# Altium schematic sheet ANA_FE_1_2.SchDoc: Analog FE:1,2
size Letter; Organization: University of California; Address1: 475 Portola Plaza; Address2: Los Angeles, CA 90095; Revision: R01; SheetNumber: 1; SheetTotal: 1
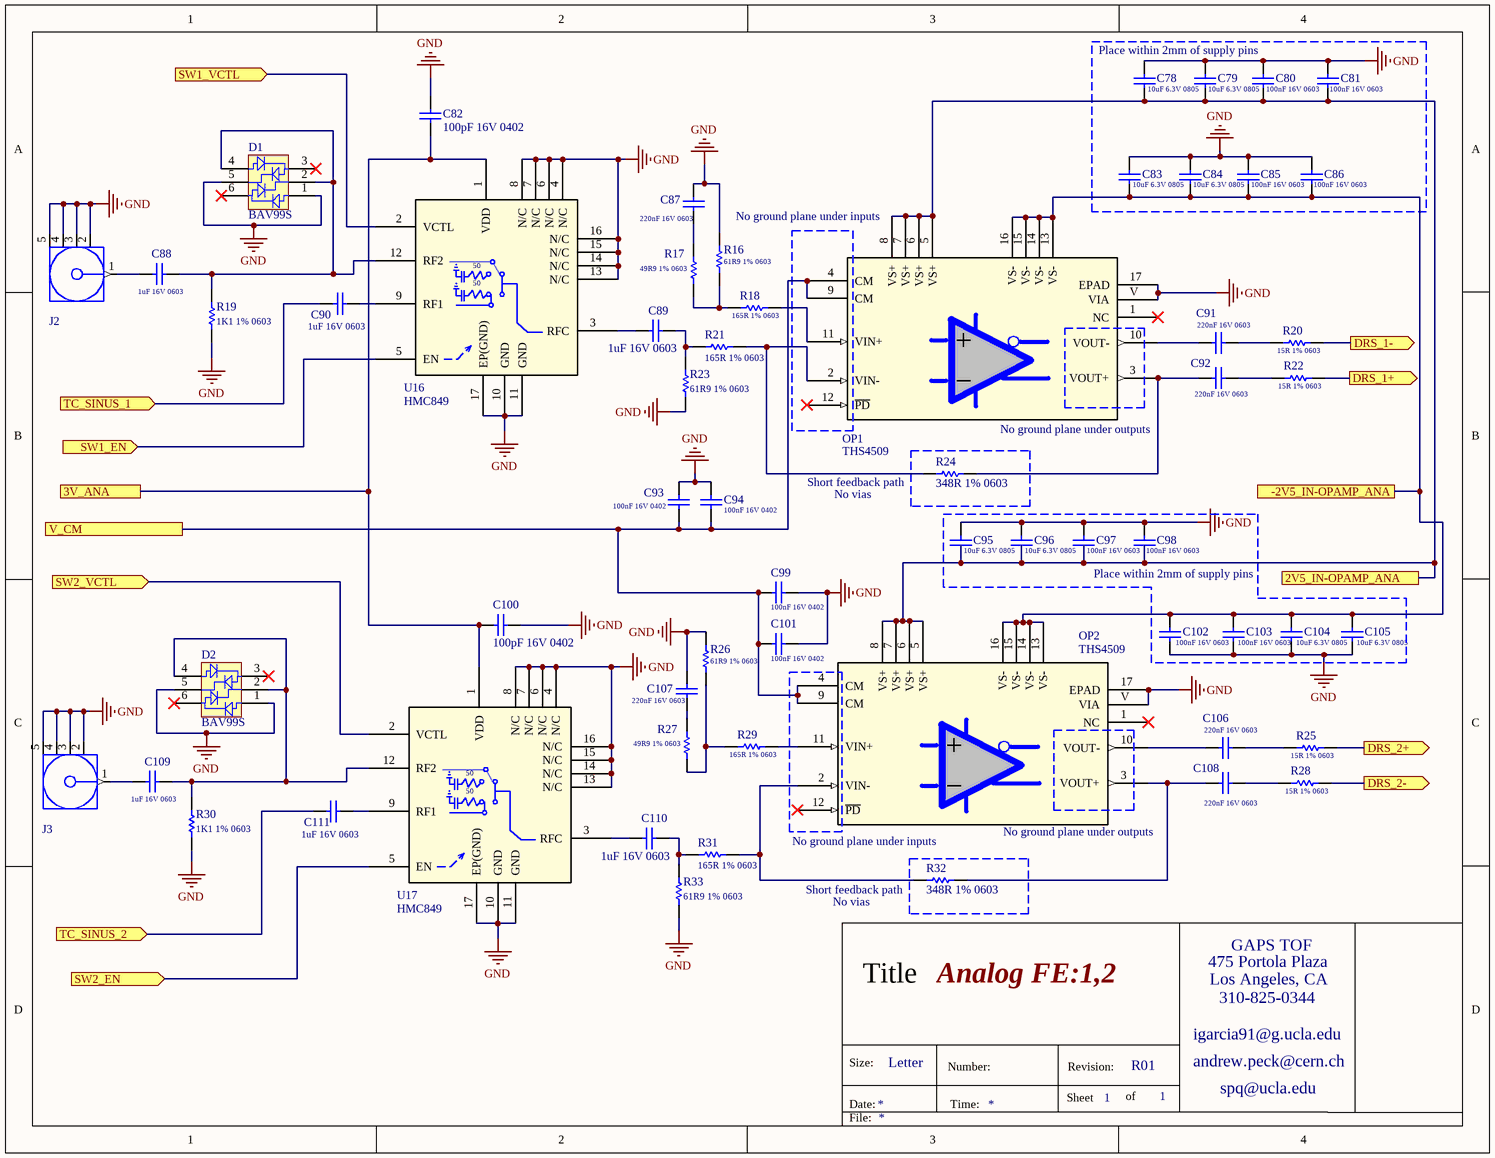
[diagram p0: ANA_FE_1_2.SchDoc]

## Parts
C78  10uF 6.3V 0805  [CAPC0805(2012)145_L]
C79  10uF 6.3V 0805  [CAPC0805(2012)145_L]
C80  100nF 16V 0603  [CAPC0603(1608)100_N]
C81  100nF 16V 0603  [CAPC0603(1608)100_N]
C82  100pF 16V 0402  [CAPC0402(1005)60_M]
C83  10uF 6.3V 0805  [CAPC0805(2012)145_L]
C84  10uF 6.3V 0805  [CAPC0805(2012)145_L]
C85  100nF 16V 0603  [CAPC0603(1608)100_N]
C86  100nF 16V 0603  [CAPC0603(1608)100_N]
C87  220nF 16V 0603  [CAPC0603(1608)100_M]
C88  1uF 16V 0603  [CAPC0603(1608)100_N]
C89  1uF 16V 0603  [CAPC0603(1608)100_N]
C90  1uF 16V 0603  [CAPC0603(1608)100_N]
C91  220nF 16V 0603  [CAPC0603(1608)100_M]
C92  220nF 16V 0603  [CAPC0603(1608)100_M]
C93  100nF 16V 0402  [CAPC0402(1005)60_M]
C94  100nF 16V 0402  [CAPC0402(1005)60_M]
C95  10uF 6.3V 0805  [CAPC0805(2012)145_L]
C96  10uF 6.3V 0805  [CAPC0805(2012)145_L]
C97  100nF 16V 0603  [CAPC0603(1608)100_N]
C98  100nF 16V 0603  [CAPC0603(1608)100_N]
C99  100nF 16V 0402  [CAPC0402(1005)60_M]
C100  100pF 16V 0402  [CAPC0402(1005)60_M]
C101  100nF 16V 0402  [CAPC0402(1005)60_M]
C102  100nF 16V 0603  [CAPC0603(1608)100_N]
C103  100nF 16V 0603  [CAPC0603(1608)100_N]
C104  10uF 6.3V 0805  [CAPC0805(2012)145_L]
C105  10uF 6.3V 0805  [CAPC0805(2012)145_L]
C106  220nF 16V 0603  [CAPC0603(1608)100_M]
C107  220nF 16V 0603  [CAPC0603(1608)100_M]
C108  220nF 16V 0603  [CAPC0603(1608)100_M]
C109  1uF 16V 0603  [CAPC0603(1608)100_N]
C110  1uF 16V 0603  [CAPC0603(1608)100_N]
C111  1uF 16V 0603  [CAPC0603(1608)100_N]
D1  BAV99S  [INF-SOT363_V]
D2  BAV99S  [INF-SOT363_V]
J2  CONREVSMA003.062  [CON-SMA-EDGE062]  (value not drawn)
J3  CONREVSMA003.062  [CON-SMA-EDGE062]  (value not drawn)
OP1  THS4509  [RGT16]
OP2  THS4509  [RGT16]
R16  61R9 1% 0603  [RESC0603(1608)_M]
R17  49R9 1% 0603  [RESC0603(1608)_N]
R18  165R 1% 0603  [RESC0603(1608)_M]
R19  1K1 1% 0603  [RESC0603(1608)_N]
R20  15R 1% 0603  [RESC0603(1608)_M]
R21  165R 1% 0603  [RESC0603(1608)_M]
R22  15R 1% 0603  [RESC0603(1608)_M]
R23  61R9 1% 0603  [RESC0603(1608)_M]
R24  348R 1% 0603  [RESC0603(1608)_N]
R25  15R 1% 0603  [RESC0603(1608)_M]
R26  61R9 1% 0603  [RESC0603(1608)_M]
R27  49R9 1% 0603  [RESC0603(1608)_N]
R28  15R 1% 0603  [RESC0603(1608)_M]
R29  165R 1% 0603  [RESC0603(1608)_M]
R30  1K1 1% 0603  [RESC0603(1608)_N]
R31  165R 1% 0603  [RESC0603(1608)_M]
R32  348R 1% 0603  [RESC0603(1608)_N]
R33  61R9 1% 0603  [RESC0603(1608)_M]
U16  HMC849  [CP_16_40]
U17  HMC849  [CP_16_40]

## Blocks framed on the sheet
Place within 2mm of supply pins: C78-C81 C83-C86
No ground plane under outputs: R24
Place within 2mm of supply pins: C95-C98 C102-C105
No ground plane under outputs: R32

## Ports
2V5_IN-OPAMP_ANA, 3V_ANA, -2V5_IN-OPAMP_ANA, DRS_1+ (out), DRS_1- (out), DRS_2+ (out), DRS_2- (out), SW1_EN (in), SW1_VCTL (in), SW2_EN (in), SW2_VCTL (in), TC_SINUS_1 (in), TC_SINUS_2 (in), V_CM

## Nets
GND: C78.2 C79.2 C80.2 C81.2 C82.2 C83.2 C84.2 C85.2 C86.2 C87.2 C93.1 C94.1 C95.2 C96.2 C97.2 C98.2 C99.1 C100.1 C101.1 C102.2 C103.2 C104.2 C105.2 C107.2 D1.1(A1) D1.5(K5) D2.1(A1) D2.5(K5) J2.2(GND) J2.3(GND) J2.4(GND) J2.5(GND) J3.2(GND) J3.3(GND) J3.4(GND) J3.5(GND) OP1.17(EPAD) OP1.V(VIA) OP2.17(EPAD) OP2.V(VIA) R16.2 R19.1 R23.1 R26.2 R30.1 R33.1 U16.4(N/C) U16.6(N/C) U16.7(N/C) U16.8(N/C) U16.10(GND) U16.11(GND) U16.13(N/C) U16.14(N/C) U16.15(N/C) U16.16(N/C) U16.17(EP(GND)) U17.4(N/C) U17.6(N/C) U17.7(N/C) U17.8(N/C) U17.10(GND) U17.11(GND) U17.13(N/C) U17.14(N/C) U17.15(N/C) U17.16(N/C) U17.17(EP(GND))
2V5_IN-OPAMP_ANA: C78.1 C79.1 C80.1 C81.1 C95.1 C96.1 C97.1 C98.1 OP1.5(VS+) OP1.6(VS+) OP1.7(VS+) OP1.8(VS+) OP2.5(VS+) OP2.6(VS+) OP2.7(VS+) OP2.8(VS+) ; port 2V5_IN-OPAMP_ANA
3V_ANA: C82.1 C100.2 U16.1(VDD) U17.1(VDD) ; port 3V_ANA
-2V5_IN-OPAMP_ANA: C83.1 C84.1 C85.1 C86.1 C102.1 C103.1 C104.1 C105.1 OP1.13(VS-) OP1.14(VS-) OP1.15(VS-) OP1.16(VS-) OP2.13(VS-) OP2.14(VS-) OP2.15(VS-) OP2.16(VS-) ; port -2V5_IN-OPAMP_ANA
DRS_1+: R22.2 ; port DRS_1+
DRS_1-: R20.2 ; port DRS_1-
DRS_2+: R25.2 ; port DRS_2+
DRS_2-: R28.2 ; port DRS_2-
SW1_EN: U16.5(EN) ; port SW1_EN
SW1_VCTL: U16.2(VCTL) ; port SW1_VCTL
SW2_EN: U17.5(EN) ; port SW2_EN
SW2_VCTL: U17.2(VCTL) ; port SW2_VCTL
TC_SINUS_1: C90.1 ; port TC_SINUS_1
TC_SINUS_2: C111.1 ; port TC_SINUS_2
V_CM: C93.2 C94.2 C99.2 C101.2 OP1.4(CM) OP1.9(CM) OP2.4(CM) OP2.9(CM) ; port V_CM
NetC87_1: C87.1 R17.2
NetC88_1: C88.1 J2.1(Signal)
NetC88_2: C88.2 D1.2(K2) D1.4(A4) R19.2 U16.12(RF2)
NetC89_1: C89.1 U16.3(RFC)
NetC89_2: C89.2 R21.1 R23.2
NetC90_2: C90.2 U16.9(RF1)
NetC91_1: C91.1 R20.1
NetC91_2: C91.2 OP1.10(VOUT-)
NetC92_1: C92.1 R22.1
NetC92_2: C92.2 OP1.3(VOUT+) R24.2
NetC106_1: C106.1 R25.1
NetC106_2: C106.2 OP2.10(VOUT-)
NetC107_1: C107.1 R27.2
NetC108_1: C108.1 R28.1
NetC108_2: C108.2 OP2.3(VOUT+) R32.2
NetC109_1: C109.1 J3.1(Signal)
NetC109_2: C109.2 D2.2(K2) D2.4(A4) R30.2 U17.12(RF2)
NetC110_1: C110.1 U17.3(RFC)
NetC110_2: C110.2 R31.1 R33.2
NetC111_2: C111.2 U17.9(RF1)
NetOP1_2: OP1.2(VIN-) R21.2 R24.1
NetOP1_11: OP1.11(VIN+) R18.2
NetOP2_2: OP2.2(VIN-) R31.2 R32.1
NetOP2_11: OP2.11(VIN+) R29.2
NetR16_1: R16.1 R17.1 R18.1
NetR26_1: R26.1 R27.1 R29.1

Not connected (* = marked no-connect by the designer): D1 3(C3)* 6(C6)*; D2 3(C3)* 6(C6)*; OP1 1(NC)* 12(~{PD})*; OP2 1(NC)* 12(~{PD})*

## Notes on the sheet
- No ground plane under inputs
- (near R24) Short feedback path
- No vias
- (near R32) Short feedback path
- 475 Portola Plaza
- GAPS TOF
- Title
- igarcia91@g.ucla.edu
- Los Angeles, CA
- 310-825-0344
- Size:
- Date:
- Letter
- Number:
- Time:
- Sheet
- Revision:
- of
- andrew.peck@cern.ch
- spq@ucla.edu
- File:
- (in symbol HMC849ALP4CE) 50

## Library data of the parts
C78 C79 C83 C84 C95 C96 C104 C105 = CMP-1036-04915-1: CAP 10uF 6.3V ±10% 0805 (2012 Metric) Thickness 1.45mm SMD; Tolerance: Â±10%; Case-EIA: 0805; Case-Metric: 2012; Technology: SMT; Rated Voltage: 6.3 V; Value: 10uF; Max Thickness: 1.45 mm
C80 C81 C85 C86 C97 C98 C102 C103 = CMP-1035-02585-1: CAP 100nF 16V ±20% 0603 (1608 Metric) Thickness 1mm SMD; Case-EIA: 0603; Tolerance: Â±20%; Case-Metric: 1608; Technology: SMT; Rated Voltage: 16 V; Value: 100nF; Max Thickness: 1 mm
C82 C100 = CMP-1034-01236-1: CAP 100pF 16V ±5% 0402 (1005 Metric) Thickness 0.6mm SMD; Case-Metric: 1005; Case-EIA: 0402; Tolerance: Â±5%; Rated Voltage: 16 V; Technology: SMT; Value: 100pF; Max Thickness: 0.6 mm
C87 C91 C92 C106-C108 = CMP-1035-02644-1: CAP 220nF 16V ±10% 0603 (1608 Metric) Thickness 1mm SMD; Tolerance: Â±10%; Case-EIA: 0603; Case-Metric: 1608; Rated Voltage: 16 V; Max Thickness: 1 mm; Technology: SMT; Value: 220nF
C88-C90 C109-C111 = CMP-1035-02736-1: CAP 1uF 16V ±5% 0603 (1608 Metric) Thickness 1mm SMD; Case-Metric: 1608; Case-EIA: 0603; Tolerance: Â±5%; Technology: SMT; Max Thickness: 1 mm; Rated Voltage: 16 V; Value: 1uF
C93 C94 C99 C101 = CMP-1034-02070-1: CAP 100nF 16V ±20% 0402 (1005 Metric) Thickness 0.6mm SMD; Tolerance: Â±20%; Case-EIA: 0402; Case-Metric: 1005; Value: 100nF; Max Thickness: 0.6 mm; Technology: SMT; Rated Voltage: 16 V
D1 D2 = CMP-1176-00030-1: Silicon Switching Diode, SOT363, Reel, Green; Manufacturer: Infineon; VR (max): 80Â V; VBR (min): 85Â V; IF (max): 200Â mA; trr (max): 4Â ns; Green: TRUE; VF (max): 1.25Â V; Configuration: Quadruple; IR (max): 150Â nA; PackageReference: SOT363; Halogen-free: TRUE; ComponentLink3URL: http://www.infineon.com/dgdl/SOT363-Package_Overview.pdf?folderId=db3a30431936bc4b01195360bd8f3cdc&fileId=db3a30431936bc4b0119536b62bf3cf5; PartNumber: BAV99S; ComponentLink3Description: Package Specification; ComponentLink2URL: http://www.infineon.com/dgdl/bav99series.pdf?folderId=db3a30431400ef6801141b5844e103ea&fileId=db3a30431400ef6801141c1b237d042f; ComponentLink1Description: Manufacturer URL; ComponentLink2Description: Datasheet; ComponentLink1URL: http://www.infineon.com/; PackageDescription: 6-Pin Small Outline Transistor Package, 1.25 x 2 mm Body; Mounting Technology: Surface Mount
J2 J3 = CMP-0168-00046-1: PCB_Layout: Pads complies with manufacturer's recommendation.; DatasheetVersion: rev1.0, Jun-2006; PackageVersion: rev1.0, Jun-2006; PackageReference: CON-SMA-EDGE062
OP1 OP2 = THS4509RGTT: Imported; Vendor: Texas Instruments; Built_By: EMA_UL_Team; C: Copyright (C) 2015 Accelerated Designs. All rights reserved; Manufacturer_Part_Number: THS4509RGTT; RefDes: RefDes; Type: DEV; Value: Value
R16 R23 R26 R33 = CMP-1012-00374-1: 61R9 0.1W 1% 0603 (1608 Metric)  SMD; Case-Metric: 1608; Case-EIA: 0603; Value: 61.90 Ohm; Technology: SMT; Tolerance: 1 %; Power: 0.1 W
R17 R27 = CMP-1012-00363-1: 49R9 0.1W 1% 0603 (1608 Metric)  SMD; Case-Metric: 1608; Case-EIA: 0603; Value: 49.90 Ohm; Power: 0.1 W; Tolerance: 1 %; Technology: SMT
R18 R21 R29 R31 = CMP-1012-00420-1: 165R 0.1W 1% 0603 (1608 Metric)  SMD; Value: 165.00 Ohm; Case-EIA: 0603; Case-Metric: 1608; Tolerance: 1 %; Power: 0.1 W; Technology: SMT
R19 R30 = CMP-1012-00514-1: 1K1 0.1W 1% 0603 (1608 Metric)  SMD; Case-Metric: 1608; Case-EIA: 0603; Value: 1100.00 Ohm; Technology: SMT; Tolerance: 1 %; Power: 0.1 W
R20 R22 R25 R28 = CMP-1012-00302-1: 15R 0.1W 1% 0603 (1608 Metric)  SMD; Case-Metric: 1608; Case-EIA: 0603; Value: 15.00 Ohm; Technology: SMT; Tolerance: 1 %; Power: 0.1 W
R24 R32 = CMP-1012-00457-1: 348R 0.1W 1% 0603 (1608 Metric)  SMD; Case-EIA: 0603; Case-Metric: 1608; Value: 348.00 Ohm; Technology: SMT; Power: 0.1 W; Tolerance: 1 %
U16 U17 = HMC849ALP4CE: Imported; Vendor: Analog Devices Inc; Built_By: Analog Devices Imc.; Manufacturer_Part_Number: HMC849ALP4CE; RefDes: RefDes; Type: DEV; Value: Value